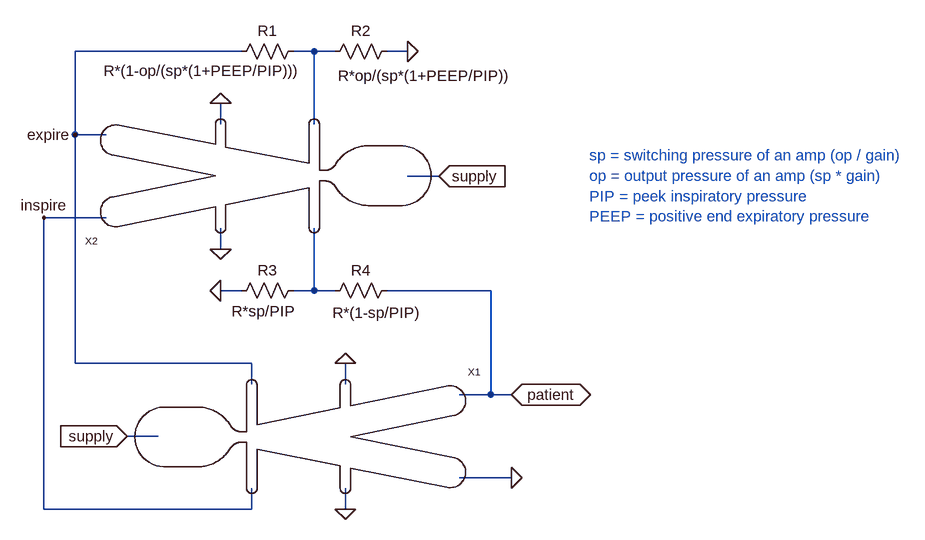
[diagram p0: schematic ventilator.asc]
ventilator.asc, the LTspice schematic file:
Version 4
SHEET 1 1188 680
WIRE 112 -192 -144 -192
WIRE 224 -192 192 -192
WIRE 256 -192 224 -192
WIRE 368 -192 336 -192
WIRE 80 -80 80 -112
WIRE 224 -80 224 -192
WIRE -144 -64 -144 -192
WIRE -96 -64 -144 -64
WIRE 416 0 368 0
WIRE -96 64 -192 64
WIRE 80 112 80 80
WIRE 112 176 80 176
WIRE 224 176 224 80
WIRE 224 176 192 176
WIRE 256 176 224 176
WIRE 496 176 336 176
WIRE -144 288 -144 -64
WIRE 128 288 -144 288
WIRE 128 320 128 288
WIRE 272 320 272 288
WIRE 496 336 496 176
WIRE 496 336 448 336
WIRE 528 336 496 336
WIRE -16 400 -64 400
WIRE 528 464 448 464
WIRE -192 512 -192 64
WIRE 128 512 128 480
WIRE 128 512 -192 512
WIRE 272 512 272 480
FLAG -64 400 supply
IOPIN -64 400 In
FLAG 416 0 supply
IOPIN 416 0 In
FLAG 80 -112 0
FLAG 80 112 0
FLAG 368 -192 0
FLAG 272 288 0
FLAG 272 512 0
FLAG 528 464 0
FLAG 528 336 patient
IOPIN 528 336 BiDir
FLAG 80 176 0
FLAG -144 -64 expire
FLAG -192 64 inspire
SYMBOL res 208 -208 R90
WINDOW 0 0 56 VBottom 2
WINDOW 3 30 157 VTop 2
SYMATTR InstName R1
SYMATTR Value R*(1-op/(sp*(1+PEEP/PIP)))
SYMBOL res 352 -208 R90
WINDOW 0 0 56 VBottom 2
WINDOW 3 38 -40 VTop 2
SYMATTR InstName R2
SYMATTR Value R*op/(sp*(1+PEEP/PIP))
SYMBOL amp_s 128 400 R0
SYMATTR InstName X1
SYMBOL amp_s 224 0 R180
SYMATTR InstName X2
SYMBOL res 208 160 R90
WINDOW 0 0 56 VBottom 2
WINDOW 3 32 63 VTop 2
SYMATTR InstName R3
SYMATTR Value R*sp/PIP
SYMBOL res 352 160 R90
WINDOW 0 0 56 VBottom 2
WINDOW 3 34 32 VTop 2
SYMATTR InstName R4
SYMATTR Value R*(1-sp/PIP)
TEXT 648 -32 Left 2 ;sp = switching pressure of an amp (op / gain)\nop = output pressure of an amp (sp * gain)\nPIP = peek inspiratory pressure\nPEEP = positive end expiratory pressure

The netlist it stands for:
* ventilator.asc
R1 N001 expire R*(1-op/(sp*(1+PEEP/PIP)))
R2 0 N001 R*op/(sp*(1+PEEP/PIP))
XX1 supply inspire expire 0 0 0 patient amp_s
XX2 supply N001 N002 0 0 expire inspire amp_s
R3 N002 0 R*sp/PIP
R4 patient N002 R*(1-sp/PIP)
* sp = switching pressure of an amp (op / gain)
* op = output pressure of an amp (sp * gain)
* PIP = peek inspiratory pressure
* PEEP = positive end expiratory pressure
.backanno
.end